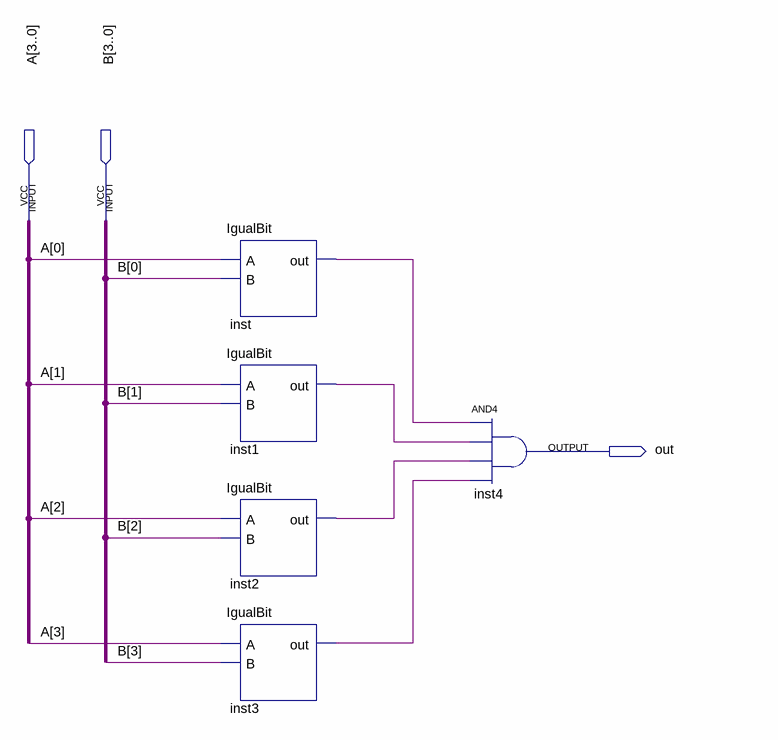
[diagram p0: schematic sheet]
// Quartus schematic Igual.bdf as structural Verilog: 5 symbols, 3 pins
module Igual (
  input  [3:0] A,
  input  [3:0] B,
  output out
);

  wire inst1_out, inst2_out, inst3_out, inst_out;

  IgualBit inst (.A(A[0]), .B(B[0]), .out(inst_out));
  IgualBit inst1 (.A(A[1]), .B(B[1]), .out(inst1_out));
  IgualBit inst2 (.A(A[2]), .B(B[2]), .out(inst2_out));
  IgualBit inst3 (.A(A[3]), .B(B[3]), .out(inst3_out));
  and inst4 (out, inst_out, inst1_out, inst2_out, inst3_out);
endmodule
